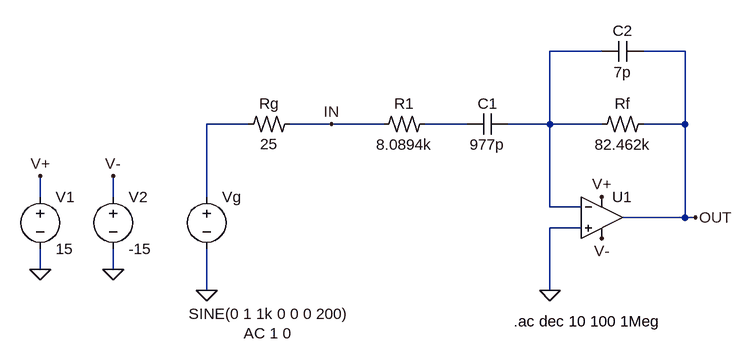
[diagram p0: schematic Differentiator_simulation.asc]
Differentiator_simulation.asc, the LTspice schematic file:
Version 4
SHEET 1 880 680
WIRE 544 -128 464 -128
WIRE 672 -128 608 -128
WIRE 0 -16 -64 -16
WIRE 128 -16 64 -16
WIRE 208 -16 128 -16
WIRE 336 -16 272 -16
WIRE 464 -16 464 -128
WIRE 464 -16 400 -16
WIRE 544 -16 464 -16
WIRE 672 -16 672 -128
WIRE 672 -16 608 -16
WIRE -320 96 -320 64
WIRE -208 96 -208 64
WIRE -64 96 -64 -16
WIRE 464 112 464 -16
WIRE 512 112 464 112
WIRE 672 128 672 -16
WIRE 672 128 576 128
WIRE 688 128 672 128
WIRE 512 144 464 144
WIRE -320 208 -320 176
WIRE -208 208 -208 176
WIRE -64 240 -64 176
WIRE 464 240 464 144
FLAG -320 208 0
FLAG -208 208 0
FLAG -320 64 V+
FLAG -208 64 V-
FLAG 464 240 0
FLAG 688 128 OUT
FLAG 128 -16 IN
FLAG 544 160 V-
FLAG 544 96 V+
FLAG -64 240 0
SYMBOL voltage -320 80 R0
WINDOW 123 24 126 Left 2
WINDOW 39 24 111 Left 2
SYMATTR InstName V1
SYMATTR Value 15
SYMBOL voltage -208 80 R0
WINDOW 123 24 126 Left 2
WINDOW 39 24 111 Left 2
SYMATTR InstName V2
SYMATTR Value -15
SYMBOL Opamps/UniversalOpamp2 544 128 R0
SYMATTR InstName U1
SYMBOL res2 272 -32 R90
WINDOW 0 0 32 VBottom 2
WINDOW 3 32 32 VTop 2
SYMATTR InstName R1
SYMATTR Value 8.0894k
SYMBOL res2 608 -32 R90
WINDOW 0 0 32 VBottom 2
WINDOW 3 32 32 VTop 2
SYMATTR InstName Rf
SYMATTR Value 82.462k
SYMBOL res2 64 -32 R90
WINDOW 0 0 32 VBottom 2
WINDOW 3 31 32 VTop 2
SYMATTR InstName Rg
SYMATTR Value 25
SYMBOL voltage -64 80 R0
WINDOW 3 -28 196 Left 2
WINDOW 123 57 226 Left 2
WINDOW 39 0 0 Left 0
SYMATTR Value SINE(0 1 1k 0 0 0 200)
SYMATTR Value2 AC 1 0
SYMATTR InstName Vg
SYMBOL cap 400 -32 R90
WINDOW 0 0 32 VBottom 2
WINDOW 3 32 32 VTop 2
SYMATTR InstName C1
SYMATTR Value 977p
SYMBOL cap 608 -144 R90
WINDOW 0 0 32 VBottom 2
WINDOW 3 32 32 VTop 2
SYMATTR InstName C2
SYMATTR Value 7p
TEXT 408 288 Left 2 !.ac dec 10 100 1Meg

The netlist it stands for:
* Differentiator_simulation.asc
V1 V+ 0 15
V2 V- 0 -15
XU1 0 N001 V+ V- OUT level.2 Avol=1Meg GBW=10Meg Slew=10Meg ilimit=25m rail=0 Vos=0 phimargin=45 en=0 enk=0 in=0 ink=0 Rin=500Meg  ; pins IN+ IN- V+ V- OUT
R1 N003 IN 8.0894k
Rf OUT N001 82.462k
Rg IN N002 25
Vg N002 0 SINE(0 1 1k 0 0 0 200) AC 1 0
C1 N001 N003 977p
C2 OUT N001 7p
.ac dec 10 100 1Meg
.lib UniversalOpamps2.sub
.backanno
.end